# Altium schematic sheet Communications.SchDoc
size A; Organization: Altium Limited; Address1: L3, 12a Rodborough Rd; Address2: Frenchs Forest; Address3: NSW; Address4: Australia 2086
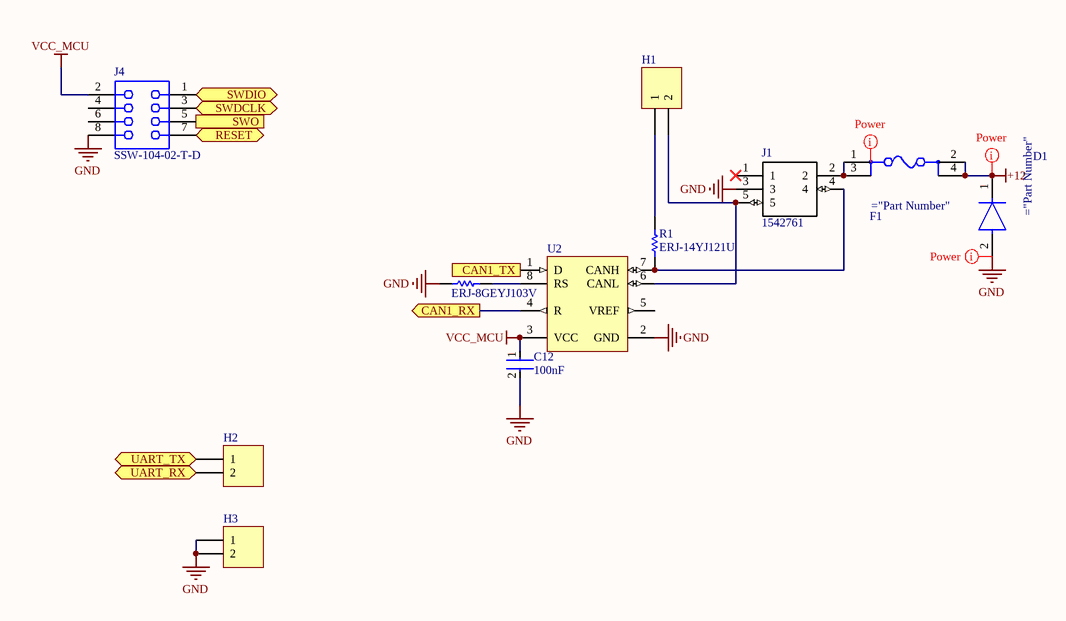
[diagram p0: Communications.SchDoc]

## Parts
C12  100nF  [Kemet_C0603_IPC_A]
D1  S1J-13-F  [Diodes_SMA_0]  (value not drawn)
F1  3557-2  [Keystone_3557-2_0]  (value not drawn)
H1  Header 0  [HDR1X2]  (value not drawn)
H2  Header 0  [HDR1X2]  (value not drawn)
H3  Header 0  [HDR1X2]  (value not drawn)
J1  1542761  [1542761]
J4  SSW-104-02-T-D  [SMTC-SSW-104-02-X-D]
R1  ERJ-14YJ121U  [RESC3225X70X50ML20T20]
R9  ERJ-8GEYJ103V  [RESC3216X70X50NL05T20]
U2  SN65HVD230D  [D0008A_M]  (value not drawn)

## Ports
CAN1_RX (out), CAN1_TX (in), RESET (bidir), SWDCLK (bidir), SWDIO (bidir), SWO (out), UART_RX (bidir), UART_TX (bidir)

## Nets
+12: D1.1(C) F1.2 F1.4
GND: C12.2 D1.2(A) H3.1 H3.2 J1.3 J4.8 R9.2 U2.2(GND)
VCC_MCU: C12.1 J4.2 U2.3(VCC)
CAN1_RX: U2.4(R) ; port CAN1_RX
CAN1_TX: U2.1(D) ; port CAN1_TX
RESET: J4.7 ; port RESET
SWDCLK: J4.3 ; port SWDCLK
SWDIO: J4.1 ; port SWDIO
SWO: J4.5 ; port SWO
UART_RX: H2.2 ; port UART_RX
UART_TX: H2.1 ; port UART_TX
NetF1_1: F1.1 F1.3 J1.2
NetH1_1: H1.1 R1.2
NetH1_2: H1.2 J1.5 U2.6(CANL)
NetJ1_4: J1.4 R1.1 U2.7(CANH)
NetR9_1: R9.1 U2.8(RS)

Not connected (* = marked no-connect by the designer): J1 1*; J4 4 6; U2 5(VREF)

## Layout directives
net class Power: (no net found under the mark), +12, GND

## Notes on the sheet
- Title
- Size:
- Date:
- A
- Number:
- Time:
- Revision:
- Sheet
- of
- File:

## Library data of the parts
C12 = C0603C104K5RACTU: CAP CER 0.1UF 100NF 50V X7R 0603 C0603C104K5RACTU
H1-H3 = Header 2: Header, 2-Pin; LatestRevisionDate: 17-Jul-2002; LatestRevisionNote: Re-released for DXP Platform.; Publisher: Altium Limited
J1 = 1542761: Connector; Manufacturer_Name: Phoenix Contact; Allied_Number: 70170366; Datasheet Link: https://media.digikey.com/PDF/Data%20Sheets/Phoenix%20Contact%20PDFs/1542761.pdf; Height: 18mm; Manufacturer_Part_Number: 1542761; Mouser Part Number: 651-1542761; Mouser Price/Stock: https://www.mouser.com/Search/Refine.aspx?Keyword=651-1542761; RS Part Number: 8025583; RS Price/Stock: http://uk.rs-online.com/web/p/products/8025583; Allied Price/Stock: https://www.alliedelec.com/phoenixcontact-1542761/70170366/
J4 = CMP-1023-00342-1: SQ Post Socket, Through-hole, Vertical, -55 to 105 degC, 2.54mm Pitch, 8-Pin, Female, RoHS; Manufacturer: Samtec; Mounting Technology: Through-hole; ComponentLink3Description: Package Specification; ComponentLink3URL: http://www.samtec.com/documents/webfiles/cpdf/SSW-1XX-XX-XXX-X-XX-XXX-XX-MKT.pdf; Temperature Range: -55 to 105 degC; DatasheetVersion: F-214; PackageVersion: CA, 6/1987; ComponentLink1URL: http://www.samtec.com; RoHS: True; Pitch: 2.54 mm; ComponentLink2Description: Datasheet; ComponentLink2URL: http://www.samtec.com/documents/webfiles/pdf/SSW_TH.PDF; PackageDescription: Assembly, Socket Strip .016 X .031 Tail; PackageReference: SSW-104-02-X-D; ComponentLink1Description: Manufacturer URL; PartNumber: SSW-104-02-T-D; Orientation: Vertical
R1 = CMP-2005-03490-1: 120Ohm; Manufacturer: Panasonic; Part Number: ERJ-14YJ121U
R9 = CMP-2003-00545-1: 10k; Manufacturer: Panasonic; Part Number: ERJ-8GEYJ103V
U2 = CMP-0315-00046-3: CAN Bus Transceiver, 3.3 V, -40 to 85 degC, 8-Pin SOIC (D), Green (RoHS & no Sb/Br), Tube; Supply Voltage Min: 3 V; Supply Voltage Max: 3.6 V; PartNumber: SN65HVD230D; ComponentLink2URL: http://www.ti.com/general/docs/lit/getliterature.tsp?genericGeneric Part Number=SN65HVD230&fileType=pdf; DatasheetVersion: SLOS346N; Generic Part Number: SN65HVD230; Packing: Tube; Temperature Min: -40 degC; Temperature Max: 85 degC; ComponentLink1Description: Manufacturer URL; Mounting Technology: Surface Mount; RoHS: TRUE; ComponentLink1URL: http://www.ti.com/; ComponentLink2Description: Datasheet; PackageDescription: 8-Pin Plastic Small Outline, Body 4.9 x 3.9 mm, Pitch 1.27 mm